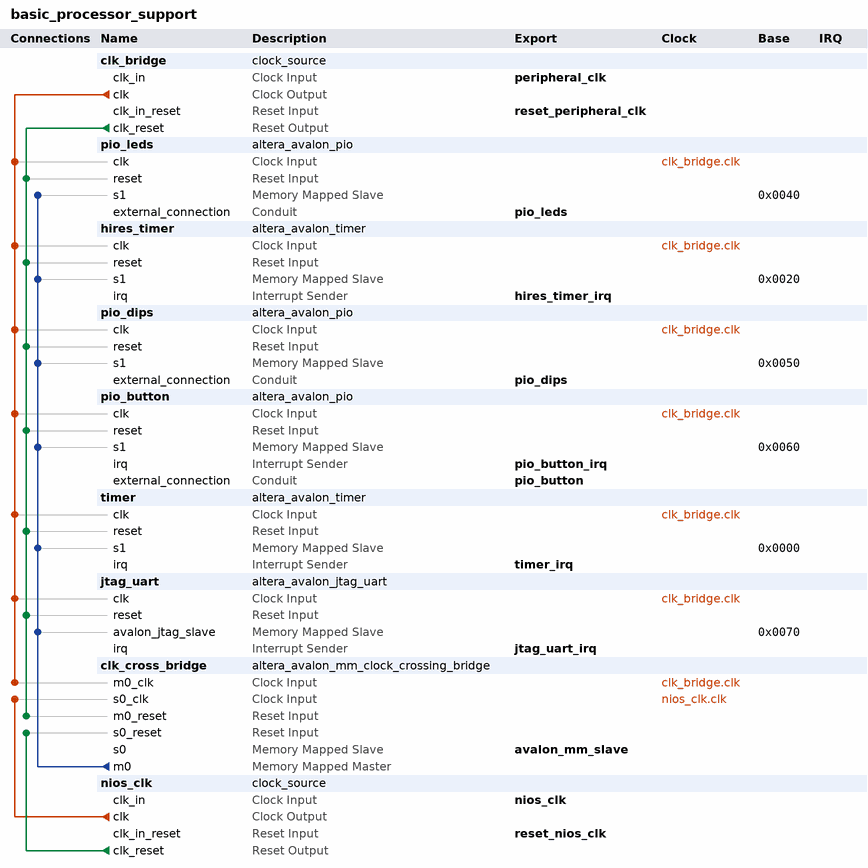
[diagram p0: system contents]
# Platform Designer (Qsys) system basic_processor_support, Stratix IV EP4SGX530KH40C2
# Parameters at their usual value, and those the tool derives, are not listed.
package require -exact qsys 16.1
create_system basic_processor_support
set_project_property DEVICE_FAMILY {Stratix IV}
set_project_property DEVICE EP4SGX530KH40C2

add_instance clk_bridge clock_source 16.1
set_instance_parameter_value clk_bridge clockFrequency 50000000
set_instance_parameter_value clk_bridge resetSynchronousEdges BOTH

add_instance pio_leds altera_avalon_pio 16.1
set_instance_parameter_value pio_leds direction Output
set_instance_parameter_value pio_leds width 9

add_instance hires_timer altera_avalon_timer 16.1
set_instance_parameter_value hires_timer period 1
set_instance_parameter_value hires_timer periodUnits MSEC

add_instance pio_dips altera_avalon_pio 16.1
set_instance_parameter_value pio_dips direction Input
set_instance_parameter_value pio_dips width 8

add_instance pio_button altera_avalon_pio 16.1
set_instance_parameter_value pio_button captureEdge true
set_instance_parameter_value pio_button direction Input
set_instance_parameter_value pio_button generateIRQ true
set_instance_parameter_value pio_button irqType EDGE
set_instance_parameter_value pio_button width 8

add_instance timer altera_avalon_timer 16.1
set_instance_parameter_value timer period 1
set_instance_parameter_value timer periodUnits MSEC

add_instance jtag_uart altera_avalon_jtag_uart 16.1
set_instance_parameter_value jtag_uart simInteractiveOptions NO_INTERACTIVE_WINDOWS

add_instance clk_cross_bridge altera_avalon_mm_clock_crossing_bridge 16.1
set_instance_parameter_value clk_cross_bridge ADDRESS_WIDTH 10
set_instance_parameter_value clk_cross_bridge COMMAND_FIFO_DEPTH 4
set_instance_parameter_value clk_cross_bridge DATA_WIDTH 32
set_instance_parameter_value clk_cross_bridge MASTER_SYNC_DEPTH 2
set_instance_parameter_value clk_cross_bridge MAX_BURST_SIZE 1
set_instance_parameter_value clk_cross_bridge RESPONSE_FIFO_DEPTH 4
set_instance_parameter_value clk_cross_bridge SLAVE_SYNC_DEPTH 2
set_instance_parameter_value clk_cross_bridge USE_AUTO_ADDRESS_WIDTH 1

add_instance nios_clk clock_source 16.1
set_instance_parameter_value nios_clk clockFrequency 50000000
set_instance_parameter_value nios_clk resetSynchronousEdges BOTH

# connections
add_connection clk_bridge.clk clk_cross_bridge.m0_clk clock
add_connection clk_bridge.clk hires_timer.clk clock
add_connection clk_bridge.clk jtag_uart.clk clock
add_connection clk_bridge.clk pio_button.clk clock
add_connection clk_bridge.clk pio_dips.clk clock
add_connection clk_bridge.clk pio_leds.clk clock
add_connection clk_bridge.clk timer.clk clock
add_connection nios_clk.clk clk_cross_bridge.s0_clk clock
add_connection clk_bridge.clk_reset clk_cross_bridge.m0_reset reset
add_connection clk_bridge.clk_reset hires_timer.reset reset
add_connection clk_bridge.clk_reset jtag_uart.reset reset
add_connection clk_bridge.clk_reset pio_button.reset reset
add_connection clk_bridge.clk_reset pio_dips.reset reset
add_connection clk_bridge.clk_reset pio_leds.reset reset
add_connection clk_bridge.clk_reset timer.reset reset
add_connection nios_clk.clk_reset clk_cross_bridge.s0_reset reset
add_connection clk_cross_bridge.m0 hires_timer.s1 avalon
set_connection_parameter_value clk_cross_bridge.m0/hires_timer.s1 baseAddress 0x0020
add_connection clk_cross_bridge.m0 jtag_uart.avalon_jtag_slave avalon
set_connection_parameter_value clk_cross_bridge.m0/jtag_uart.avalon_jtag_slave baseAddress 0x0070
add_connection clk_cross_bridge.m0 pio_button.s1 avalon
set_connection_parameter_value clk_cross_bridge.m0/pio_button.s1 baseAddress 0x0060
add_connection clk_cross_bridge.m0 pio_dips.s1 avalon
set_connection_parameter_value clk_cross_bridge.m0/pio_dips.s1 baseAddress 0x0050
add_connection clk_cross_bridge.m0 pio_leds.s1 avalon
set_connection_parameter_value clk_cross_bridge.m0/pio_leds.s1 baseAddress 0x0040
add_connection clk_cross_bridge.m0 timer.s1 avalon
set_connection_parameter_value clk_cross_bridge.m0/timer.s1 baseAddress 0x0000

# exported interfaces
add_interface avalon_mm_slave avalon slave
set_interface_property avalon_mm_slave EXPORT_OF clk_cross_bridge.s0
add_interface hires_timer_irq interrupt sender
set_interface_property hires_timer_irq EXPORT_OF hires_timer.irq
add_interface jtag_uart_irq interrupt sender
set_interface_property jtag_uart_irq EXPORT_OF jtag_uart.irq
add_interface nios_clk clock sink
set_interface_property nios_clk EXPORT_OF nios_clk.clk_in
add_interface peripheral_clk clock sink
set_interface_property peripheral_clk EXPORT_OF clk_bridge.clk_in
add_interface pio_button conduit end
set_interface_property pio_button EXPORT_OF pio_button.external_connection
add_interface pio_button_irq interrupt sender
set_interface_property pio_button_irq EXPORT_OF pio_button.irq
add_interface pio_dips conduit end
set_interface_property pio_dips EXPORT_OF pio_dips.external_connection
add_interface pio_leds conduit end
set_interface_property pio_leds EXPORT_OF pio_leds.external_connection
add_interface reset_nios_clk reset sink
set_interface_property reset_nios_clk EXPORT_OF nios_clk.clk_in_reset
add_interface reset_peripheral_clk reset sink
set_interface_property reset_peripheral_clk EXPORT_OF clk_bridge.clk_in_reset
add_interface timer_irq interrupt sender
set_interface_property timer_irq EXPORT_OF timer.irq

set_interconnect_requirement {$system} qsys_mm.clockCrossingAdapter AUTO
set_interconnect_requirement {$system} qsys_mm.maxAdditionalLatency 1

save_system basic_processor_support.qsys
